# Altium schematic sheet newwind.SchDoc
size A3
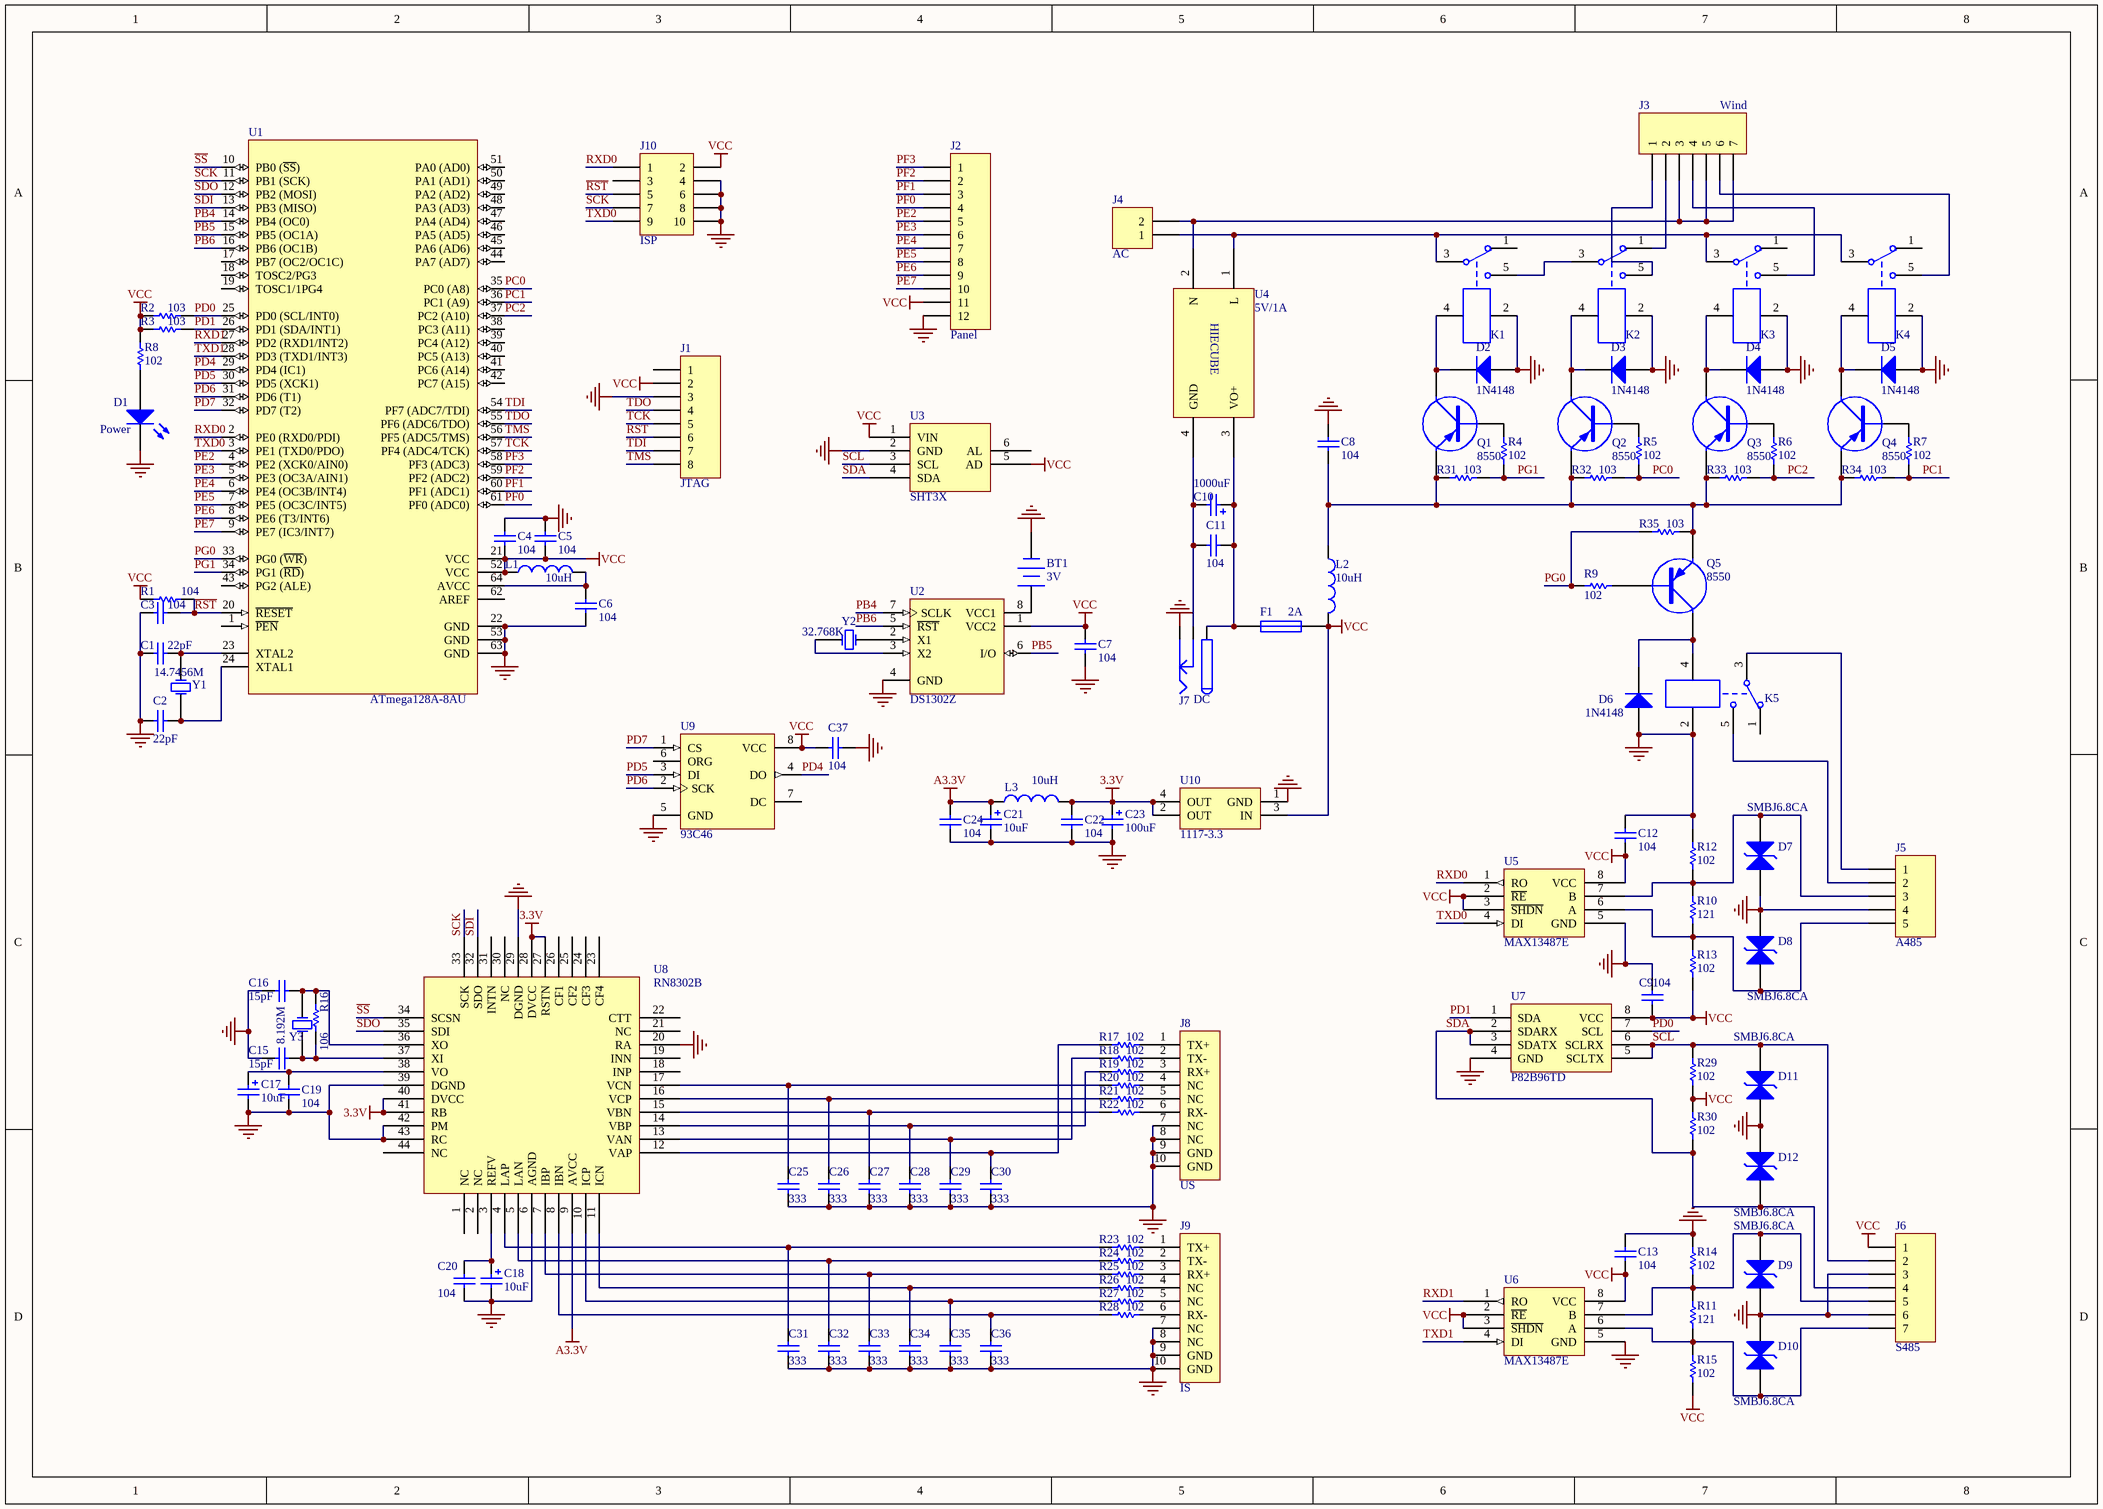
[diagram p0: newwind.SchDoc]

## Parts
BT1  3V  [CR2032]
C1  22pF  [0805]
C2  22pF  [0805]
C3  104  [0805]
C4  104  [0805]
C5  104  [0805]
C6  104  [0805]
C7  104  [0805]
C8  104  [0805]
C9  104  [0805]
C10  1000uF  [C10]
C11  104  [0805]
C12  104  [0805]
C13  104  [0805]
C15  15pF  [0805]
C16  15pF  [0805]
C17  10uF  [C1206]
C18  10uF  [C1206]
C19  104  [0805]
C20  104  [0805]
C21  10uF  [C1206]
C22  104  [0805]
C23  100uF  [C1210]
C24  104  [0805]
C25  333  [0805]
C26  333  [0805]
C27  333  [0805]
C28  333  [0805]
C29  333  [0805]
C30  333  [0805]
C31  333  [0805]
C32  333  [0805]
C33  333  [0805]
C34  333  [0805]
C35  333  [0805]
C36  333  [0805]
C37  104  [0805]
D1  Power  [LED-2P]
D2  1N4148  [1206]
D3  1N4148  [1206]
D4  1N4148  [1206]
D5  1N4148  [1206]
D6  1N4148  [1206]
D7  SMBJ6.8CA  [SMB]
D8  SMBJ6.8CA  [SMB]
D9  SMBJ6.8CA  [SMB]
D10  SMBJ6.8CA  [SMB]
D11  SMBJ6.8CA  [SMB]
D12  SMBJ6.8CA  [SMB]
F1  2A  [1812]
J1  JTAG  [CON8]
J2  Panel  [XH2.54-12P]
J3  Wind  [2EDG-3.81-7P]
J4  AC  [2EDG-3.81-2P]
J5  A485  [2EDG-3.81-5P]
J6  S485  [2EDG-3.81-7P]
J7  DC  [PWR2.5]
J8  US  [RJ-45]
J9  IS  [RJ-45]
J10  ISP  [DC3-10]
K1  (no value)  [T73]
K2  (no value)  [T73]
K3  (no value)  [T73]
K4  (no value)  [T73]
K5  (no value)  [T73]
L1  10uH  [0805]
L2  10uH  [0805]
L3  10uH  [0805]
Q1  8550  [SOT-23-3]
Q2  8550  [SOT-23-3]
Q3  8550  [SOT-23-3]
Q4  8550  [SOT-23-3]
Q5  8550  [SOT-23-3]
R1  104  [0805]
R2  103  [0805]
R3  103  [0805]
R4  102  [0805]
R5  102  [0805]
R6  102  [0805]
R7  102  [0805]
R8  102  [0805]
R9  102  [0805]
R10  121  [0805]
R11  121  [0805]
R12  102  [0805]
R13  102  [0805]
R14  102  [0805]
R15  102  [0805]
R16  106  [0805]
R17  102  [0805]
R18  102  [0805]
R19  102  [0805]
R20  102  [0805]
R21  102  [0805]
R22  102  [0805]
R23  102  [0805]
R24  102  [0805]
R25  102  [0805]
R26  102  [0805]
R27  102  [0805]
R28  102  [0805]
R29  102  [0805]
R30  102  [0805]
R31  103  [0805]
R32  103  [0805]
R33  103  [0805]
R34  103  [0805]
R35  103  [0805]
U1  ATmega128A-8AU  [ATMega128]
U2  DS1302Z  [SOP-8P-3.9]
U3  SHT3X  [SHT3X]
U4  5V/1A  [HIECUBE12W]
U5  MAX13487E  [SOP-8P-3.9]
U6  MAX13487E  [SOP-8P-3.9]
U7  P82B96TD  [SOP-8P-3.9]
U8  RN8302B  [QFP-44P-0.8]
U9  93C46  [SOP-8P-3.9]
U10  1117-3.3  [SOT-223]
Y1  14.7456M  [CRYSTAL-2P]
Y2  32.768K  [32.768K]
Y3  8.192M  [CRYSTAL-2P]

## Nets
3.3V: C22.2 C23.1 L3.2 U8.27(RSTN) U8.28(DVCC) U8.40(DVCC) U8.41(RB) U10.2(OUT) U10.4(OUT)
A3.3V: C21.1 C24.2 L3.1 U8.9(AVCC)
GND: BT1.2(-) C1.1 C2.1 C3.1 C4.2 C5.2 C6.1 C7.1 C8.2 C9.2 C12.2 C13.1 C15.1 C16.2 C17.2 C18.2 C19.2 C20.1 C21.2 C22.1 C23.2 C24.1 C25.2 C26.2 C27.2 C28.2 C29.2 C30.2 C31.2 C32.2 C33.2 C34.2 C35.2 C36.2 C37.2 D1.2(K) D2.1(A) D3.1(A) D4.1(A) D5.1(A) D6.1(A) D7.2(K) D8.1(A) D9.2(K) D10.1(A) D11.2(K) D12.1(A) J1.3 J2.12 J5.4 J6.3 J6.6 J7.2 J8.7(NC) J8.8(NC) J8.9(GND) J8.10(GND) J9.7(NC) J9.8(NC) J9.9(GND) J9.10(GND) J10.4 J10.6 J10.8 J10.10 K1.2 K2.2 K3.2 K4.2 K5.2 R12.2 R14.2 U1.22(GND) U1.53(GND) U1.63(GND) U2.4(GND) U3.2(GND) U5.5(GND) U6.5(GND) U7.4(GND) U8.6(AGND) U8.20(RA) U8.29(DGND) U8.39(DGND) U8.42(PM) U8.43(RC) U9.5(GND) U10.1(GND)
VCC: C4.1 C5.1 C7.2 C9.1 C12.1 C13.2 C37.1 F1.2 J1.2 J2.11 J6.1 J10.2 L1.1 L2.2 R1.1 R2.1 R3.1 R8.2 R13.1 R15.1 R29.1 R30.2 U1.21(VCC) U1.52(VCC) U2.1(VCC2) U3.1(VIN) U3.5(AD) U5.2(~{RE}) U5.3(~{SHDN}) U5.8(VCC) U6.2(~{RE}) U6.3(~{SHDN}) U6.8(VCC) U7.8(VCC) U9.8(VCC) U10.3(IN)
PB4: U1.14(PB4_(OC0)) U2.7(SCLK)
PB5: U1.15(PB5_(OC1A)) U2.6(I/O)
PB6: U1.16(PB6_(OC1B)) U2.5(~{RST})
PC0: R5.1 R32.2 U1.35(PC0_(A8))
PC1: R7.1 R34.2 U1.36(PC1_(A9))
PC2: R6.1 R33.2 U1.37(PC2_(A10))
PD0: R2.2 U1.25(PD0_(SCL/INT0)) U7.7(SCL)
PD1: R3.2 U1.26(PD1_(SDA/INT1)) U7.1(SDA)
PD4: U1.29(PD4_(IC1)) U9.4(DO)
PD5: U1.30(PD5_(XCK1)) U9.3(DI)
PD6: U1.31(PD6_(T1)) U9.2(SCK)
PD7: U1.32(PD7_(T2)) U9.1(CS)
PE2: J2.5 U1.4(PE2_(XCK0/AIN0))
PE3: J2.6 U1.5(PE3_(OC3A/AIN1))
PE4: J2.7 U1.6(PE4_(OC3B/INT4))
PE5: J2.8 U1.7(PE5_(OC3C/INT5))
PE6: J2.9 U1.8(PE6_(T3/INT6))
PE7: J2.10 U1.9(PE7_(IC3/INT7))
PF0: J2.4 U1.61(PF0_(ADC0))
PF1: J2.3 U1.60(PF1_(ADC1))
PF2: J2.2 U1.59(PF2_(ADC2))
PF3: J2.1 U1.58(PF3_(ADC3))
PG0: R9.2 R35.1 U1.33(PG0_(~{WR}))
PG1: R4.1 R31.2 U1.34(PG1_(~{RD}))
~{RST}: C3.2 J1.6 J10.5 R1.2 U1.20(~{RESET})
RXD0: J10.1 U1.2(PE0_(RXD0/PDI)) U5.1(RO)
RXD1: U1.27(PD2_(RXD1/INT2)) U6.1(RO)
~{SS}: U1.10(PB0_(~{SS})) U8.34(SCSN)
SCK: J10.7 U1.11(PB1_(SCK)) U8.33(SCK)
SCL: D11.1(A) J6.2 R29.2 U3.3(SCL) U7.5(SCLTX) U7.6(SCLRX)
SDA: D12.2(K) J6.4 R30.1 U3.4(SDA) U7.2(SDARX) U7.3(SDATX)
SDI: U1.13(PB3_(MISO)) U8.32(SDO)
SDO: U1.12(PB2_(MOSI)) U8.35(SDI)
TCK: J1.5 U1.57(PF4_(ADC4/TCK))
TDI: J1.7 U1.54(PF7_(ADC7/TDI))
TDO: J1.4 U1.55(PF6_(ADC6/TDO))
TMS: J1.8 U1.56(PF5_(ADC5/TMS))
TXD0: J10.9 U1.3(PE1_(TXD0/PDO)) U5.4(DI)
TXD1: U1.28(PD3_(TXD1/INT3)) U6.4(DI)
NetBT1_1: BT1.1(+) U2.8(VCC1)
NetC1_2: C1.2 U1.23(XTAL2) Y1.2(OSC2)
NetC2_2: C2.2 U1.24(XTAL1) Y1.1(OSC1)
NetC6_2: C6.2 L1.2 U1.64(AVCC)
NetC8_1: C8.1 L2.1 Q1.2(E) Q2.2(E) Q3.2(E) Q4.2(E) Q5.2(E) R31.1 R32.1 R33.1 R34.1 R35.2
NetC10_1: C10.1 C11.1 F1.1 J7.1 U4.3(VO+)
NetC10_2: C10.2 C11.2 J7.3 U4.4(GND)
NetC15_2: C15.2 R16.1 U8.37(XI) Y3.1(OSC1)
NetC16_1: C16.1 R16.2 U8.36(XO) Y3.2(OSC2)
NetC17_1: C17.1 C19.1 U8.38(VO)
NetC18_1: C18.1 C20.2 U8.3(REFV)
NetC25_1: C25.1 R20.1 U8.17(VCN)
NetC26_1: C26.1 R21.1 U8.16(VCP)
NetC27_1: C27.1 R22.1 U8.15(VBN)
NetC28_1: C28.1 R19.1 U8.14(VBP)
NetC29_1: C29.1 R18.1 U8.13(VAN)
NetC30_1: C30.1 R17.1 U8.12(VAP)
NetC31_1: C31.1 R23.1 U8.4(LAP)
NetC32_1: C32.1 R24.1 U8.5(LAN)
NetC33_1: C33.1 R25.1 U8.7(IBP)
NetC34_1: C34.1 R26.1 U8.11(ICN)
NetC35_1: C35.1 R27.1 U8.10(ICP)
NetC36_1: C36.1 R28.1 U8.8(IBN)
NetD1_1: D1.1(A) R8.1
NetD2_2: D2.2(K) K1.4 Q1.3(C)
NetD3_2: D3.2(K) K2.4 Q2.3(C)
NetD4_2: D4.2(K) K3.4 Q3.3(C)
NetD5_2: D5.2(K) K4.4 Q4.3(C)
NetD6_2: D6.2(K) K5.4 Q5.3(C)
NetD7_1: D7.1(A) J5.3 R10.2 R12.1 U5.7(B)
NetD8_2: D8.2(K) J5.5 R10.1 R13.2 U5.6(A)
NetD9_1: D9.1(A) J6.5 R11.2 R14.1 U6.7(B)
NetD10_2: D10.2(K) J6.7 R11.1 R15.2 U6.6(A)
NetJ3_1: J3.1 K2.5
NetJ3_2: J3.2 K2.1
NetJ3_3: J3.3 J3.5 J3.7 J4.2 U4.2(N)
NetJ3_4: J3.4 K3.5
NetJ3_6: J3.6 K4.5
NetJ4_1: J4.1 K1.3 K3.3 K4.3 U4.1(L)
NetJ5_1: J5.1 K5.3
NetJ5_2: J5.2 K5.5
NetJ8_1: J8.1(TX+) R17.2
NetJ8_2: J8.2(TX-) R18.2
NetJ8_3: J8.3(RX+) R19.2
NetJ8_4: J8.4(NC) R20.2
NetJ8_5: J8.5(NC) R21.2
NetJ8_6: J8.6(RX-) R22.2
NetJ9_1: J9.1(TX+) R23.2
NetJ9_2: J9.2(TX-) R24.2
NetJ9_3: J9.3(RX+) R25.2
NetJ9_4: J9.4(NC) R26.2
NetJ9_5: J9.5(NC) R27.2
NetJ9_6: J9.6(RX-) R28.2
NetK1_5: K1.5 K2.3
NetQ1_1: Q1.1(B) R4.2
NetQ2_1: Q2.1(B) R5.2
NetQ3_1: Q3.1(B) R6.2
NetQ4_1: Q4.1(B) R7.2
NetQ5_1: Q5.1(B) R9.1
NetU2_2: U2.2(X1) Y2.1(OSC1)
NetU2_3: U2.3(X2) Y2.2(OSC2)

Not connected (* = marked no-connect by the designer): J1 1; J10 3; K1 1; K3 1; K4 1; K5 1; U1 1(~{PEN}) 17(PB7_(OC2/OC1C)) 18(TOSC2/PG3) 19(TOSC1/1PG4) 38(PC3_(A11)) 39(PC4_(A12)) 40(PC5_(A13)) 41(PC6_(A14)) 42(PC7_(A15)) 43(PG2_(ALE)) 44(PA7_(AD7)) 45(PA6_(AD6)) 46(PA5_(AD5)) 47(PA4_(AD4)) 48(PA3_(AD3)) 49(PA2_(AD2)) 50(PA1_(AD1)) 51(PA0_(AD0)) 62(AREF); U3 6(AL); U8 1(NC) 2(NC) 18(INP) 19(INN) 21(NC) 22(CTT) 23(CF4) 24(CF3) 25(CF2) 26(CF1) 30(NC) 31(INTN) 44(NC); U9 6(ORG) 7(DC)

## Notes on the sheet
- (in symbol HIECUBE12W) HIECUBE

## Library data of the parts
BT1 = Battery: Multicell Battery; Published: *; LatestRevisionDate: *; LatestRevisionNote: *; PackageReference: *; Publisher: *
C1-C9 C11-C13 C15 C16 C19 C20 C22 C24-C37 = Cap1: Capacitor; Published: *; LatestRevisionDate: *; LatestRevisionNote: *; Publisher: *
C10 C17 C18 C21 C23 = Cap2: 电解电容; Published: 8-Jun-2000; LatestRevisionDate: 17-Jul-2002; LatestRevisionNote: Re-released for DXP Platform.; PackageReference: C0805; Publisher: Altium Limited
D1 = LED: Typical INFRARED GaAs LED; Published: *; LatestRevisionDate: *; LatestRevisionNote: *; Publisher: *
D2-D6 = Diode: Default Diode; Published: 8-Jun-2000; LatestRevisionDate: 17-Jul-2002; LatestRevisionNote: Re-released for DXP Platform.; PackageDocument: Sep-1996; PackageReference: SMC; Publisher: Altium Limited; Code_JEDEC: DO-214-AB
D7-D12 = TVS: Published: 8-Jun-2000; LatestRevisionDate: 17-Jul-2002; LatestRevisionNote: Re-released for DXP Platform.; Publisher: Altium Limited
F1 = Fuse 1: Fuse; Published: 8-Jun-2000; LatestRevisionDate: 17-Jul-2002; LatestRevisionNote: Re-released for DXP Platform.; PackageReference: PIN-W2/E2.8; Publisher: Altium Limited
J1 = MHDR1X8: Header, 8-Pin; LatestRevisionDate: 17-Jul-2002; LatestRevisionNote: Re-released for DXP Platform.; Publisher: Altium Limited
J2 = Header 12: Header, 12-Pin; LatestRevisionDate: 17-Jul-2002; LatestRevisionNote: Re-released for DXP Platform.; Publisher: Altium Limited
J3 J6 = MHDR1X7: Header, 7-Pin; LatestRevisionDate: 17-Jul-2002; LatestRevisionNote: Re-released for DXP Platform.; Publisher: Altium Limited
J4 = MHDR1X2: Header, 2-Pin; LatestRevisionDate: 17-Jul-2002; LatestRevisionNote: Re-released for DXP Platform.; Publisher: Altium Limited
J5 = MHDR1X5: Header, 5-Pin; LatestRevisionDate: 17-Jul-2002; LatestRevisionNote: Re-released for DXP Platform.; Publisher: Altium Limited
J7 = PWR2.5: 2.5电源插座; Published: 17-Dec-2003; DatasheetDocument: 09-May-2002; Publisher: Altium Limited
J8 J9 = RJ45: RJ45水晶座
J10 = Header 5X2: Header, 5-Pin, Dual row; LatestRevisionDate: *; LatestRevisionNote: *; Publisher: *
K1-K5 = Relay-6P: 6脚继电器
L1 = Inductor: Published: *; LatestRevisionDate: *; LatestRevisionNote: *; PackageReference: *; Publisher: *; Code_JEITA: *; Code_IEC: *
L2 L3 = Inductor: Code_IEC: 1005; Published: 8-Jun-2000; LatestRevisionDate: 17-Jul-2002; LatestRevisionNote: Re-released for DXP Platform.; PackageReference: 0402-A; Publisher: Altium Limited; Code_JEITA: 0402
Q1-Q5 = 8550: PNP三极管
R1-R35 = Res: Resistor
  R1-R3 R31-R35: Published: *; LatestRevisionDate: *; LatestRevisionNote: *; Publisher: *
  R4-R30: Published: 8-Jun-2000; LatestRevisionDate: 17-Jul-2002; LatestRevisionNote: Re-released for DXP Platform.; Publisher: Altium Limited
U1 = ATmega128L-8AC: 8-Bit AVR Microcontroller with 128K Bytes of In-System Programmable Flash Memory; Published: *; LatestRevisionDate: *; LatestRevisionNote: *; DatasheetVersion: *; PackageVersion: *; PackageReference: *; Publisher: *; PackageDescription: *; Code_JEDEC: *; ComponentLink1Description: *; ComponentLink1URL: *; ComponentLink2Description: *; ComponentLink2URL: *
U2 = DS1302Z: Trickle Charge Timekeeping Chip; Published: 13-Oct-2000; LatestRevisionDate: 13-Apr-2006; LatestRevisionNote: IPC-7351 Footprint Added.; DatasheetVersion: 2-Jul-1999; PackageVersion: 1999; PackageReference: SOIC8N; Publisher: Altium Limited; PackageDescription: 8-Pin Small Outline Integrated Circuit 1.27 mm Pitch; Code_IPC: SOIC127P600-8; ComponentLink1Description: Manufacturer Link; ComponentLink1URL: http://www.maxim-ic.com/; ComponentLink2Description: Datasheet; ComponentLink2URL: http://pdfserv.maxim-ic.com/en/ds/DS1302.pdf; ComponentLink3Description: Discontinuation Notice; ComponentLink3URL: http://www.maxim-ic.com/qa/pdfs/non-obsolescence-letter.pdf
U4 = HIECUBE12W: 12W单输出模块
U9 = 93C46: SPI EEPROM; Note: Do Not Use pin number 7 (DU).; Published: 24-Aug-2001; LatestRevisionDate: 6-Jun-2005; LatestRevisionNote: Stylized 3D Model Added.; DatasheetDocument: Jun-1997; PackageDocument: Jul-1999; PackageReference: SOP8; Publisher: Altium Limited; ComponentLink1Description: Manufacturer Link; ComponentLink1URL: http://www.st.com/
U10 = 1117: 800mA 稳压; PackageDocument: revC; Published: 8-Jun-2000; LatestRevisionDate: 17-Jul-2002; LatestRevisionNote: Re-released for DXP Platform.; DatasheetDocument: Sep-1997; PackageReference: ZZ311; Publisher: Altium Limited; ComponentLink1Description: Manufacturer Link; ComponentLink1URL: http://www.ti.com/
Y1-Y3 = CRYSTAL-2: Crystal Oscillator; Published: *; LatestRevisionDate: *; LatestRevisionNote: *; PackageReference: *; Publisher: *